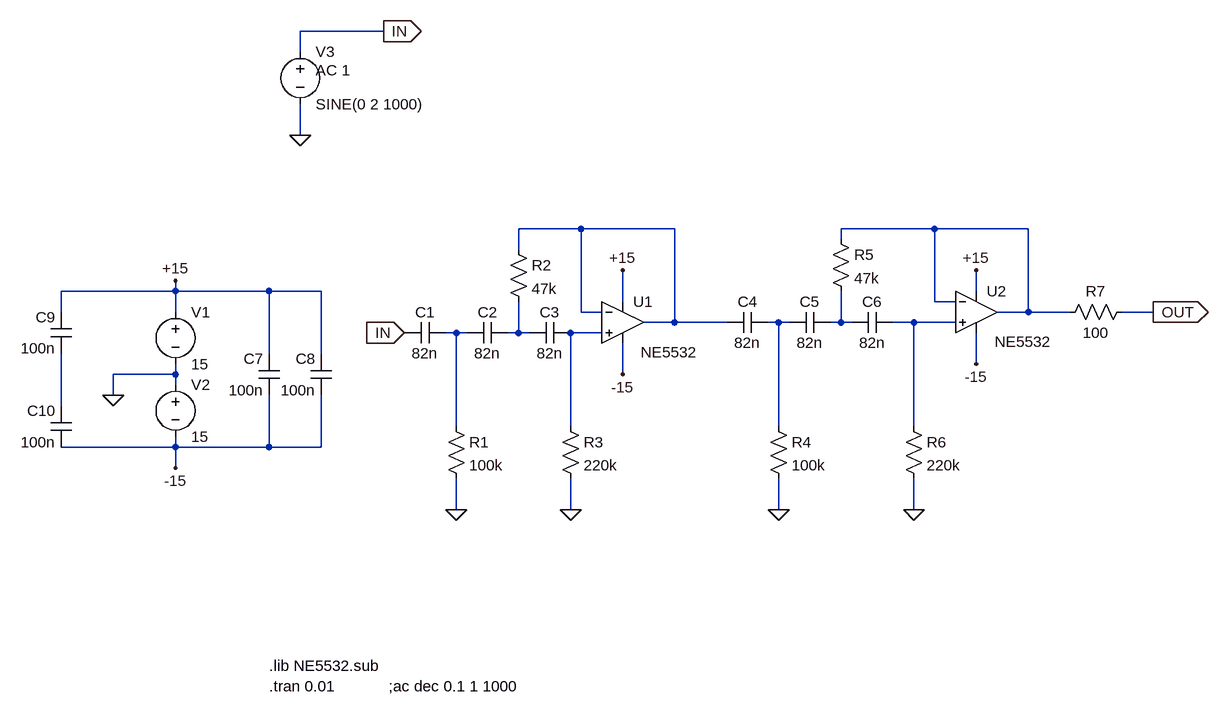
[diagram p0: schematic Infrasonic.asc]
Infrasonic.asc, the LTspice schematic file:
Version 4
SHEET 1 1240 680
WIRE -224 -352 -352 -352
WIRE -352 -320 -352 -352
WIRE -352 -192 -352 -240
WIRE 80 -48 -16 -48
WIRE 224 -48 80 -48
WIRE 624 -48 480 -48
WIRE 768 -48 624 -48
WIRE 480 -32 480 -48
WIRE -16 -16 -16 -48
WIRE -544 48 -544 32
WIRE -544 48 -720 48
WIRE -400 48 -544 48
WIRE -320 48 -400 48
WIRE 688 48 688 16
WIRE 144 64 144 16
WIRE 624 64 624 -48
WIRE 656 64 624 64
WIRE -720 80 -720 48
WIRE -544 80 -544 48
WIRE 80 80 80 -48
WIRE 112 80 80 80
WIRE 768 80 768 -48
WIRE 768 80 720 80
WIRE 832 80 768 80
WIRE 960 80 912 80
WIRE 224 96 224 -48
WIRE 224 96 176 96
WIRE 304 96 224 96
WIRE 384 96 368 96
WIRE 400 96 384 96
WIRE 480 96 480 48
WIRE 480 96 464 96
WIRE 496 96 480 96
WIRE 592 96 560 96
WIRE 656 96 592 96
WIRE -112 112 -128 112
WIRE -96 112 -112 112
WIRE -16 112 -16 64
WIRE -16 112 -32 112
WIRE 0 112 -16 112
WIRE 112 112 64 112
WIRE -400 144 -400 48
WIRE -320 144 -320 48
WIRE 688 160 688 112
WIRE -544 176 -544 160
WIRE -544 176 -640 176
WIRE 144 176 144 128
WIRE -544 192 -544 176
WIRE -640 208 -640 176
WIRE -720 224 -720 144
WIRE -112 256 -112 112
WIRE 64 256 64 112
WIRE 384 256 384 96
WIRE 592 256 592 96
WIRE -544 288 -544 272
WIRE -544 288 -720 288
WIRE -400 288 -400 208
WIRE -400 288 -544 288
WIRE -320 288 -320 208
WIRE -320 288 -400 288
WIRE -544 320 -544 288
WIRE -112 384 -112 336
WIRE 64 384 64 336
WIRE 384 384 384 336
WIRE 592 384 592 336
FLAG -640 208 0
FLAG -544 32 +15
FLAG 144 16 +15
FLAG -544 320 -15
FLAG 144 176 -15
FLAG -112 384 0
FLAG 64 384 0
FLAG -192 112 IN
IOPIN -192 112 In
FLAG 384 384 0
FLAG 592 384 0
FLAG 688 16 +15
FLAG 688 160 -15
FLAG 960 80 OUT
IOPIN 960 80 Out
FLAG -352 -192 0
FLAG -224 -352 IN
IOPIN -224 -352 Out
SYMBOL Opamps\\opamp2 144 32 R0
WINDOW 3 28 110 Left 2
SYMATTR InstName U1
SYMATTR Value NE5532
SYMBOL voltage -544 64 R0
SYMATTR InstName V1
SYMATTR Value 15
SYMBOL voltage -544 176 R0
SYMATTR InstName V2
SYMATTR Value 15
SYMBOL cap -128 96 R90
WINDOW 0 0 32 VBottom 2
WINDOW 3 32 32 VTop 2
SYMATTR InstName C1
SYMATTR Value 82n
SYMBOL cap -32 96 R90
WINDOW 0 0 32 VBottom 2
WINDOW 3 32 32 VTop 2
SYMATTR InstName C2
SYMATTR Value 82n
SYMBOL cap 64 96 R90
WINDOW 0 0 32 VBottom 2
WINDOW 3 32 32 VTop 2
SYMATTR InstName C3
SYMATTR Value 82n
SYMBOL cap 368 80 R90
WINDOW 0 0 32 VBottom 2
WINDOW 3 32 32 VTop 2
SYMATTR InstName C4
SYMATTR Value 82n
SYMBOL cap 464 80 R90
WINDOW 0 0 32 VBottom 2
WINDOW 3 32 32 VTop 2
SYMATTR InstName C5
SYMATTR Value 82n
SYMBOL cap 560 80 R90
WINDOW 0 0 32 VBottom 2
WINDOW 3 32 32 VTop 2
SYMATTR InstName C6
SYMATTR Value 82n
SYMBOL res -128 240 R0
SYMATTR InstName R1
SYMATTR Value 100k
SYMBOL res -32 -32 R0
SYMATTR InstName R2
SYMATTR Value 47k
SYMBOL res 48 240 R0
SYMATTR InstName R3
SYMATTR Value 220k
SYMBOL res 368 240 R0
SYMATTR InstName R4
SYMATTR Value 100k
SYMBOL res 464 -48 R0
SYMATTR InstName R5
SYMATTR Value 47k
SYMBOL res 576 240 R0
SYMATTR InstName R6
SYMATTR Value 220k
SYMBOL res 928 64 R90
WINDOW 0 0 56 VBottom 2
WINDOW 3 32 56 VTop 2
SYMATTR InstName R7
SYMATTR Value 100
SYMBOL cap -384 208 R180
WINDOW 0 24 56 Left 2
WINDOW 3 24 8 Left 2
SYMATTR InstName C7
SYMATTR Value 100n
SYMBOL cap -304 208 R180
WINDOW 0 24 56 Left 2
WINDOW 3 24 8 Left 2
SYMATTR InstName C8
SYMATTR Value 100n
SYMBOL Opamps\\opamp2 688 16 R0
WINDOW 3 28 110 Left 2
SYMATTR InstName U2
SYMATTR Value NE5532
SYMBOL cap -704 144 R180
WINDOW 0 24 56 Left 2
WINDOW 3 24 8 Left 2
SYMATTR InstName C9
SYMATTR Value 100n
SYMBOL cap -704 288 R180
WINDOW 0 24 56 Left 2
WINDOW 3 24 8 Left 2
SYMATTR InstName C10
SYMATTR Value 100n
SYMBOL voltage -352 -336 R0
WINDOW 123 24 44 Left 2
WINDOW 39 0 0 Left 0
SYMATTR InstName V3
SYMATTR Value SINE(0 2 1000)
SYMATTR Value2 AC 1
TEXT -400 656 Left 2 !.tran 0.01
TEXT -400 624 Left 2 !.lib NE5532.sub
TEXT -216 656 Left 2 !;ac dec 0.1 1 1000

The netlist it stands for:
* Infrasonic.asc
XU1 N008 N001 +15 -15 N001 NE5532  ; pins In+ In- V+ V- OUT
V1 +15 0 15
V2 0 -15 15
C1 N006 IN 82n
C2 N007 N006 82n
C3 N008 N007 82n
C4 N003 N001 82n
C5 N004 N003 82n
C6 N005 N004 82n
R1 N006 0 100k
R2 N001 N007 47k
R3 N008 0 220k
R4 N003 0 100k
R5 N002 N004 47k
R6 N005 0 220k
R7 OUT N002 100
C7 -15 +15 100n
C8 -15 +15 100n
XU2 N005 N002 +15 -15 N002 NE5532  ; pins In+ In- V+ V- OUT
C9 N009 +15 100n
C10 -15 N009 100n
V3 IN 0 SINE(0 2 1000) AC 1
.tran 0.01
.lib NE5532.sub
;ac dec 0.1 1 1000
.backanno
.end